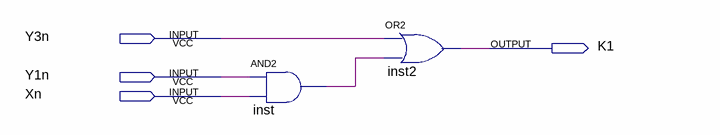
[diagram p0: schematic sheet]
// Quartus schematic K1.bdf as structural Verilog: 2 symbols, 4 pins
module K1 (
  input  Y3n,
  input  Y1n,
  input  Xn,
  output K1
);

  wire inst_out;

  and inst (inst_out, Y1n, Xn);
  or inst2 (K1, Y3n, inst_out);
endmodule
